# EAGLE design inductionlooper (EAGLE 9.5.2)
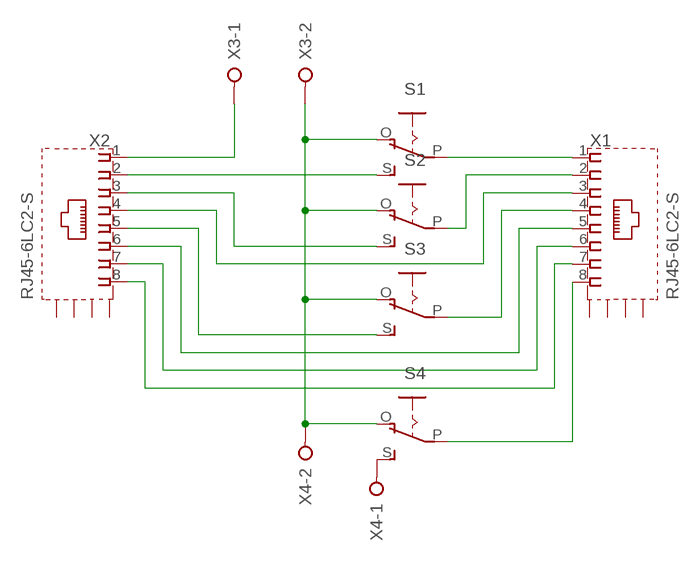
[diagram p0: schematic, sheet 1]

## Parts
S1  EG1218S  [EG1218]
S2  EG1218S  [EG1218]
S3  EG1218S  [EG1218]
S4  EG1218S  [EG1218]
X1  RJ45-6LC2-S  [RJ45-SHIELD2]
X2  RJ45-6LC2-S  [RJ45-SHIELD2]
X3  W237-02P  [W237-132]
X4  W237-02P  [W237-132]

## Nets
N$1: X2.1 X3.1
N$2: S1.P X1.1
N$3: S1.S X2.2
N$4: X1.5 X2.6
N$5: S2.P X1.2
N$6: S2.S X2.3
N$7: X1.3 X2.4
N$8: S3.P X1.4
N$9: S1.O S2.O S3.O S4.O X3.2 X4.2
N$10: S3.S X2.5
N$11: X1.6 X2.7
N$12: X1.7 X2.8
N$13: S4.P X1.8
N$14: S4.S X4.1
Unconnected: X1.S1(S) X1.S2(S) X1.S3(S) X1.S4(S) X2.S1(S) X2.S2(S) X2.S3(S) X2.S4(S)

## Library data of the parts
S1-S4 = adafruit:EG1218: SLIDING SWITCH 0.1" spacing through hole, vertical SPDT slide switch http://www.ladyada.net/library/pcb/eaglelibrary.html
X1 X2 = con-tycoelectronics:RJ45*2: RJ45 Low Profile Shield Type 2 For all RJ45 L, LC, LCT and X Series Models Source: www.tycoelectronics.com .. ENG_DS_1654001_1099_RJ_L_0507.pdf; MPN: RJ45-6LC2-S; OC_FARNELL: unknown; OC_NEWARK: 16R6095
X3 X4 = con-wago-508:W237-02P: WAGO SREW CLAMP; OC_FARNELL: unknown; OC_NEWARK: unknown

## Board
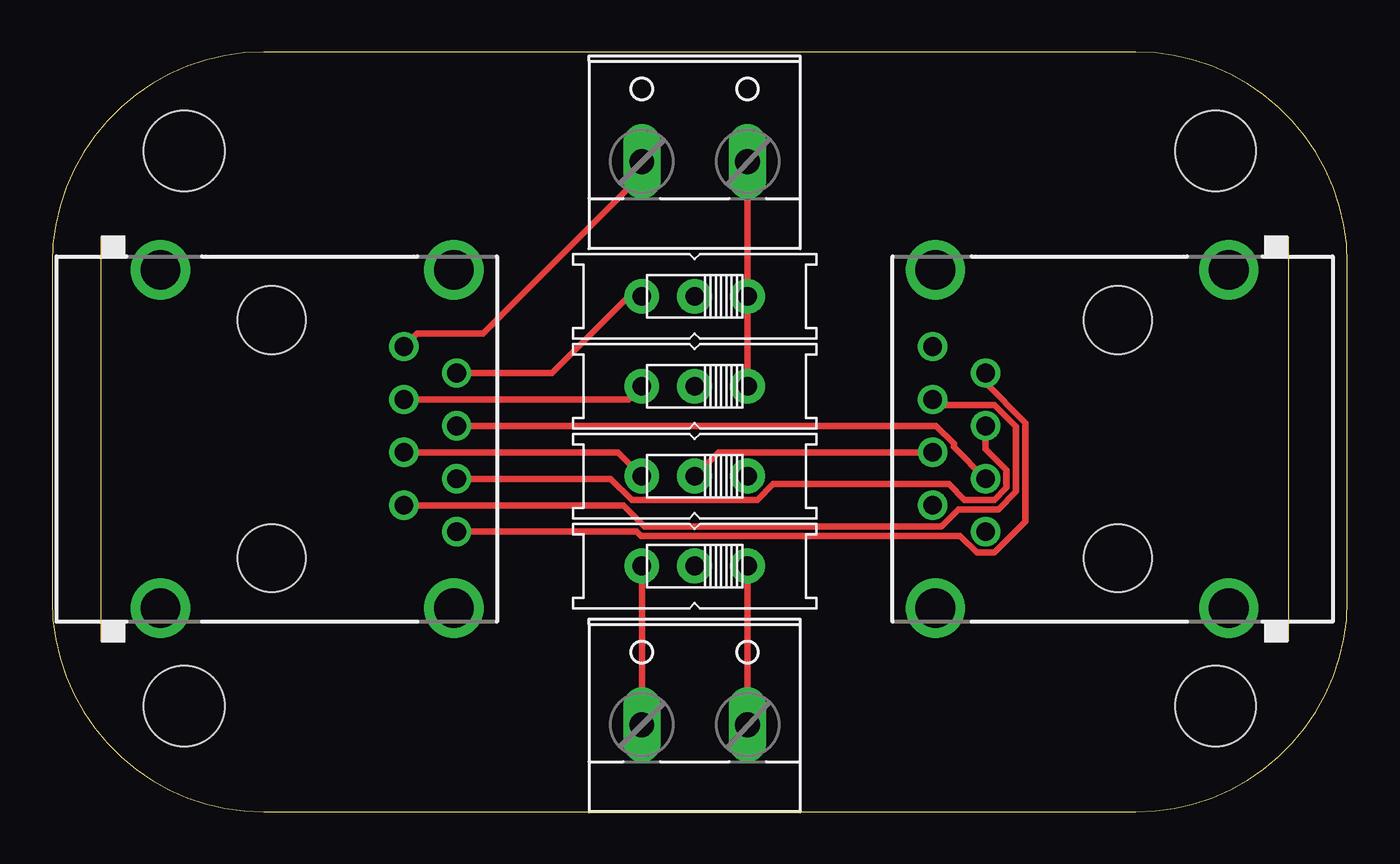
[diagram p1: board, top side]
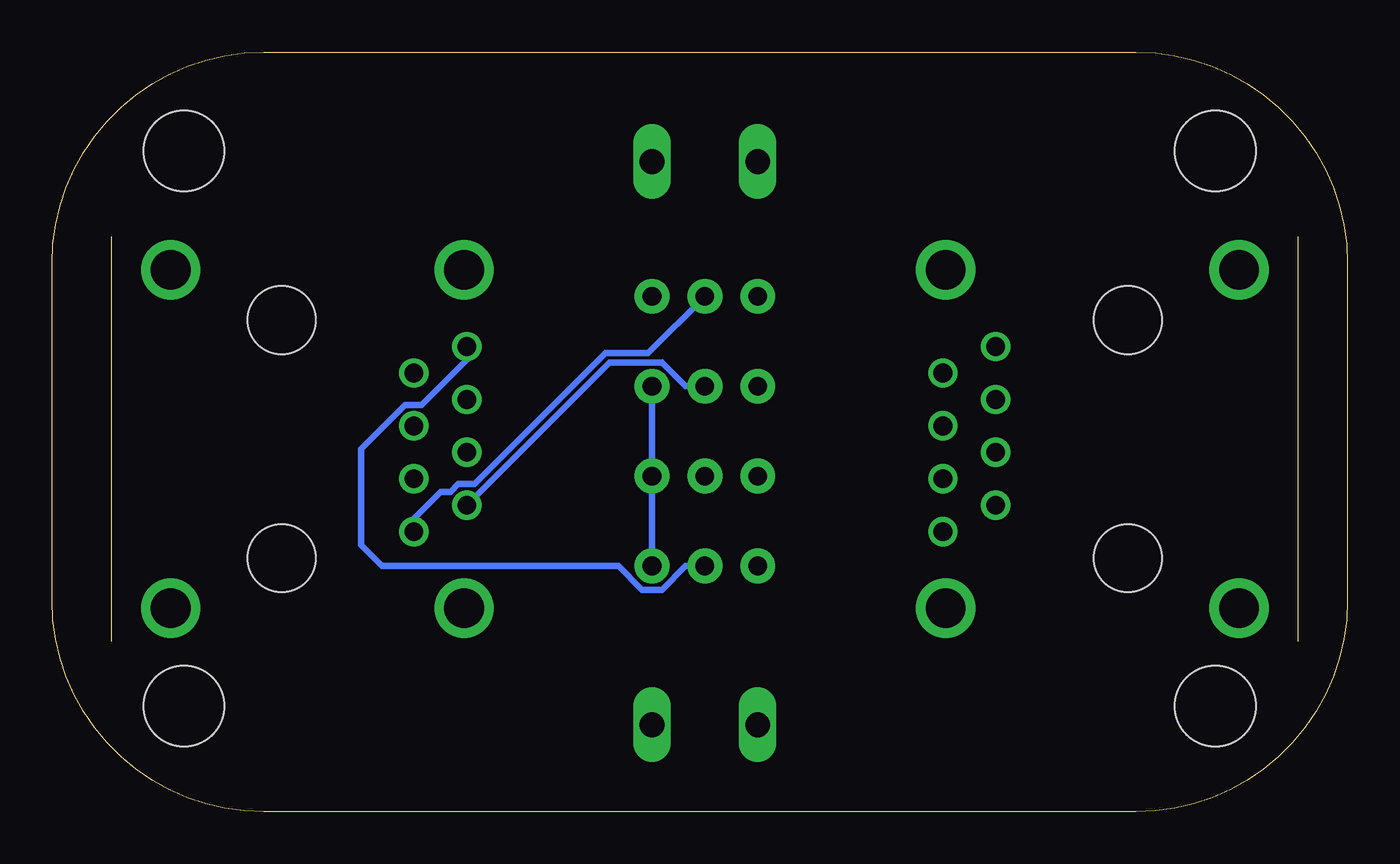
[diagram p2: board, bottom side, seen from below]

Size 62.21 x 36.5 mm. Coordinates in mm from the lower left corner, seen from the top.
Outline: 0,26.34 0,10.16 arc90 10.16,0 52.05,0 arc90 62.21,10.16 62.21,26.34 arc90 52.05,36.5 10.16,36.5 arc90 0,26.34
Copper layers (1*16): Top 0.035mm / dielectric 0.15mm / Bottom 0.035mm
Design rules "default": minimum track width 6mil, minimum drill 0.35mm, track to track 6mil, track to pad 6mil, pad to pad 6mil, via to via 6mil, smd to smd 6mil, copper to edge 40mil, drill to drill 6mil, minimum pad ring 10mil, minimum via ring 8mil, stop-mask expansion 4mil, vias tented up to drill 0mil, thermal gap 10mil
Holes 3.87 mm at 6.35,31.75 55.88,31.75 55.88,5.08 6.35,5.08

### Footprints (pad centres in the part's own frame; a part is rotated, then mirrored left to right if it is on the bottom)
EG1218 = drill 0.9 pad 1.676: O -2.54,0; P 0,0; S 2.54,0
RJ45-SHIELD2 = drill 0.9 pad 1.4: 1 -4.445,6.35; 2 -3.175,8.89; 3 -1.905,6.35; 4 -0.635,8.89; 5 0.635,6.35; 6 1.905,8.89; 7 3.175,6.35; 8 4.445,8.89 | drill 1.9 pad 2.5: S1 -8.128,-5.33; S2 8.128,-5.33; S3 -8.128,8.76; S4 8.128,8.76 | hole 3.251: -5.715,0; 5.715,0
W237-132 = drill 1.194 long: 1 -2.54,-0.635; 2 2.54,-0.635

### Placement (x,y rotation side)
S1  30.86,24.77 180 top
S2  30.86,20.45 180 top
S3  30.86,16.13 180 top
S4  30.86,11.81 180 top
X1  51.18,17.91 90 top
X2  10.54,17.91 270 top
X3  30.86,31.88 0 top
X4  30.86,4.83 0 top

### Tracks (layer width: path | path; a pad name or v marks a point on that pad's centre or on a via)
N$1
  Top 0.305: X2.1 17.53,22.99 20.7,22.99 28.32,30.61 X3.1
N$2
  Bottom 0.305: S1.P 33.58,22.05 35.62,22.05 41.93,15.74 42.71,15.74 43.08,15.37 43.56,15.37 44.83,14.1 X1.1
N$3
  Top 0.305: X2.2 24,21.08 27.69,24.77 S1.S
N$4
  Top 0.305: X2.6 26.83,16 27.85,14.99 33.87,14.99 34.63,15.74 43.08,15.74 43.82,14.99 45.25,14.99 45.84,15.58 45.84,16.42 44.83,17.43 X1.5
N$5
  Bottom 0.305: S2.P 31.79,20.45 32.93,21.59 35.43,21.59 X1.2
N$6
  Top 0.305: X2.3 27.69,19.81 S2.S
N$7
  Top 0.305: X1.3 43.3,17.53 43.3,17.69 42.45,18.54 X2.4
N$8
  Top 0.305: X1.4 32,17.27 S3.P
N$9
  Top 0.305: S2.O S1.O X3.2 | S4.O X4.2
  Bottom 0.305: S2.O S3.O S4.O
N$10
  Top 0.305: X2.5 27.18,17.27 S3.S
N$11
  Top 0.305: X2.7 27.45,14.73 28.46,13.72 42.71,13.72 43.52,14.54 45.44,14.54 46.3,15.39 46.3,18.5 45.25,19.55 42.55,19.55 X1.6
N$12
  Top 0.305: X2.8 28.08,13.46 28.27,13.27 43.6,13.27 44.41,12.45 45.25,12.45 46.75,13.96 46.75,18.69 44.83,20.61 X1.7
N$13
  Bottom 0.305: 42.55,22.09 X1.8 42.29,21.72 44.46,19.55 45.25,19.55 47.37,17.43 47.37,12.83 46.35,11.81 35.02,11.81 33.87,10.67 32.93,10.67 31.79,11.81 S4.P
N$14
  Top 0.305: S4.S X4.1

### Text on the board
tValues: Induction | Looper | ↓ / ↓ / ↓ / ↓ | 1 / 2 / 4 / 8 | Sebastius
bValues: Blow amplifier at own risk! | 40m - 2 / 80m - 1 | 10m - 8 / 20m - 4 | git.io/JvITx | All at 8Ω